# EAGLE design iv4_4lw_tubes_1.2.2 (EAGLE 5.07)
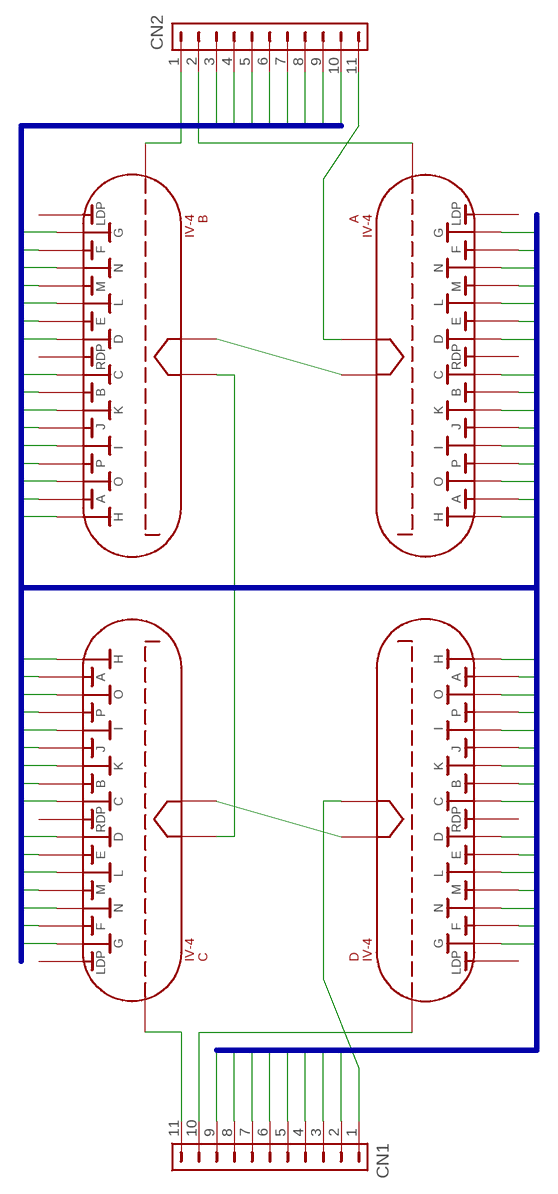
[diagram p0: schematic, sheet 1]

## Parts
A  IV-4  [IV-4]
B  IV-4  [IV-4]
C  IV-4  [IV-4]
CN1  HDR-1X11-SIP-100  [SIP-100-11V]
CN2  HDR-1X11-SIP-100  [SIP-100-11V]
D  IV-4  [IV-4]

## Nets
N$1: A.11 B.1
N$2: B.11 C.1
N$3: C.11 D.1
N$4: CN1.1 D.11
N$5: C.12 CN1.11
N$6: CN1.10 D.12
N$7: B.12 CN2.1
N$8: A.12 CN2.2
N$9: A.1 CN2.11
SEG1: A.3 B.3 C.3 CN2.7 D.3
SEG2: A.9 B.9 C.9 CN1.7 D.9
SEG4: A.14 B.14 C.14 CN1.5 D.14
SEG5: A.15 B.15 C.15 CN1.4 D.15
SEG6: A.19 B.19 C.19 CN2.4 D.19
SEG7: A.20 B.20 C.20 CN2.5 D.20
SEG9: A.6 B.6 C.6 CN2.10 D.6
SEG10: A.7 B.7 C.7 CN1.9 D.7
SEG11: A.8 B.8 C.8 CN1.8 D.8
SEG12: A.16 B.16 C.16 CN1.3 D.16
SEG13: A.17 B.17 C.17 CN1.2 D.17
SEG14: A.18 B.18 C.18 CN2.3 D.18
SEG15: A.4 B.4 C.4 CN2.8 D.4
SEG16: A.5 B.5 C.5 CN2.9 D.5
SEG17: A.21 B.21 C.21 CN2.6 D.21
SEG18: A.13 B.13 C.13 CN1.6 D.13
Unconnected: A.2 A.10 B.2 B.10 C.2 C.10 D.2 D.10

## Buses
SEG[1..18]

## Library data of the parts
A B C D = IV-4:IV-4
CN1 CN2 = con-hdrs40:HDR-1X11: HEADER CONNECTOR

## Board
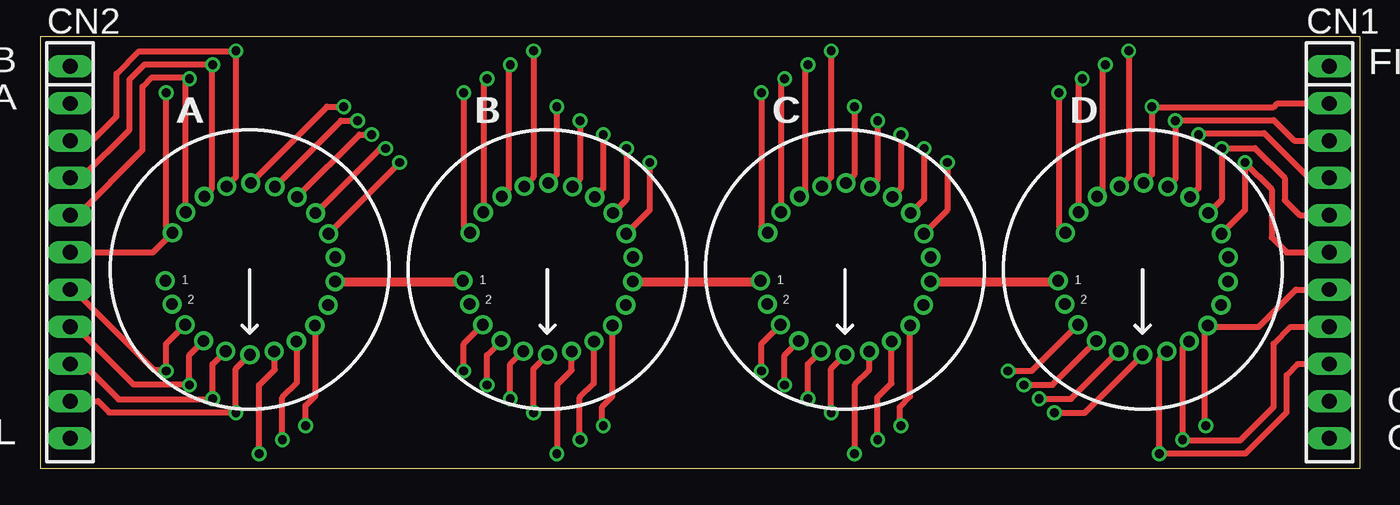
[diagram p1: board, top side]
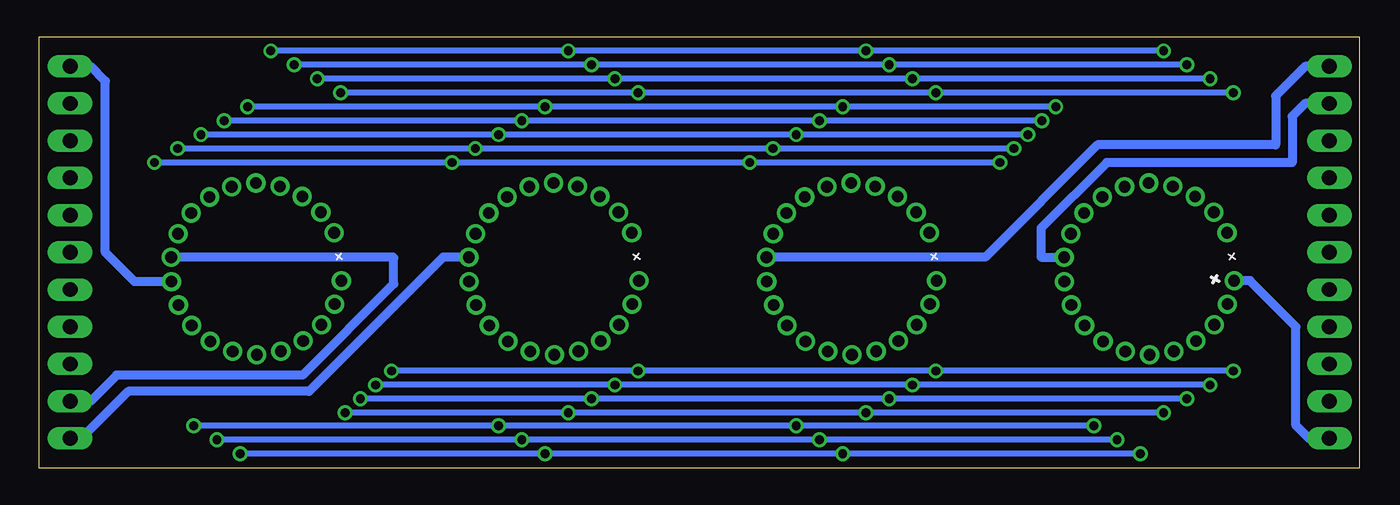
[diagram p2: board, bottom side, seen from below]

Size 90.13 x 29.46 mm. Coordinates in mm from the lower left corner, seen from the top.
Outline: 0,0 90.13,0 90.13,29.45 0,29.46 0,0
Copper layers (1*16): Top 0.035mm / dielectric 1.5mm / Bottom 0.035mm
Design rules "default *": minimum track width 8mil, minimum drill 5mil, track to track 5mil, track to pad 5mil, pad to pad 5mil, via to via 5mil, smd to smd 5mil, copper to edge 10mil, drill to drill 8mil, minimum pad ring 10mil, minimum via ring 8mil, stop-mask expansion 4mil, vias tented up to drill 0mil, thermal gap 10mil

### Footprints (pad centres in the part's own frame; a part is rotated, then mirrored left to right if it is on the bottom)
IV-4 = drill 0.8 round: 1 -5.769,-0.759; 2 -5.308,-2.362; 3 -4.414,-3.77; 4 -3.16,-4.869; 5 -1.647,-5.571; 6 0.003,-5.817; 7 1.655,-5.589; 8 3.176,-4.904; 9 4.442,-3.819; 10 5.352,-2.421; 11 5.831,-0.824; 12 5.84,0.844; 13 5.379,2.447; 14 4.485,3.855; 15 3.231,4.954; 16 1.717,5.655; 17 0.068,5.902; 18 -1.584,5.674; 19 -3.105,4.989; 20 -4.372,3.904; 21 -5.281,2.506
SIP-100-11V = drill 1.016 long: 1 -12.7,0; 2 -10.16,0; 3 -7.62,0; 4 -5.08,0; 5 -2.54,0; 6 0,0; 7 2.54,0; 8 5.08,0; 9 7.62,0; 10 10.16,0; 11 12.7,0

### Placement (x,y rotation side)
A  14.33,13.56 0 top
B  34.65,13.56 0 top
C  54.97,13.56 0 top
CN1  88.03,14.73 270 top
CN2  2.06,14.73 270 top
D  75.29,13.56 0 top

### Tracks (layer width: path | path; a pad name or v marks a point on that pad's centre or on a via)
N$1
  Top 0.61: B.1 28.81,12.74 A.11
N$2
  Top 0.61: C.1 49.13,12.74 B.11
N$3
  Top 0.61: D.1 69.45,12.74 C.11
N$4
  Bottom 0.61: D.11 83.62,12.74 85.62,14.73 85.62,26.42 86.64,27.43 CN1.1
N$5
  Bottom 0.61: C.12 62.56,14.4 71.72,5.24 84.07,5.24 87.27,2.03 CN1.11
N$6
  Bottom 0.61: D.12 65.99,14.4 65.94,14.35 65.94,12.57 72.16,6.35 84.86,6.35 86.64,4.57 CN1.10
N$7
  Bottom 0.61: B.12 25.55,14.4 17.88,22.07 5.73,22.07 5.73,25.41 3.71,27.43 CN2.1
N$8
  Bottom 0.61: A.12 21.74,14.4 21.74,16.38 17.26,20.86 4.6,20.86 4.6,24 3.71,24.89 CN2.2
N$9
  Bottom 0.61: A.1 7.49,12.8 4.34,9.65 4.34,2.92 3.45,2.03 CN2.11
SEG1  (via drill 0.6)
  Top 0.406: C.3 49.25,8.49 v49.25,6.64 | B.3 28.93,8.49 v28.93,6.64 | A.3 8.61,8.49 v8.61,6.64 8.52,6.73 7.77,6.73 2.31,12.19 CN2.7 | v66.09,6.64 67.72,6.64 D.3
  Bottom 0.406: v66.09,6.64 v49.25,6.64 v28.93,6.64 v8.61,6.64 8.61,6.61 8.62,6.6
SEG2  (via drill 0.6)
  Top 0.406: 79.63,2.91 v79.61,2.89 v79.6,2.89 | A.9 18.82,9.69 18.82,4.95 18.14,4.27 v18.14,2.89 | B.9 39.09,4.9 38.38,4.19 38.38,2.97 v38.46,2.89 | C.9 59.41,4.9 58.7,4.19 58.7,2.97 v58.78,2.89 | v79.6,2.89 79.53,2.89 79.53,9.54 D.9 79.82,9.65 83.21,9.65 85.75,12.19 CN1.7 | v79.6,2.89 79.63,2.92
  Bottom 0.406: v79.6,2.89 v58.78,2.89 v38.46,2.89 v18.14,2.89
SEG4  (via drill 0.6)
  Top 0.406: A.14 23.21,21.82 v23.6,21.82 | B.14 40.04,18.33 v40.04,21.82 | C.14 60.36,18.33 v60.36,21.82 | D.14 80.68,18.33 v80.68,21.82 80.71,21.85 82.95,21.85 84.99,19.81 84.99,18.29 86,17.27 CN1.5
  Bottom 0.406: v80.68,21.82 v60.36,21.82 39.98,21.82 | v23.6,21.82 39.98,21.82 | v40.04,21.82 40.04,21.86 40.03,21.87 39.98,21.82
SEG5  (via drill 0.6)
  Top 0.406: A.15 21.81,22.77 v22.64,22.77 | B.15 38.46,19.09 v38.46,22.77 | C.15 58.78,19.09 v58.78,22.77 | D.15 79.1,19.09 v79.1,22.77 79.19,22.86 83.59,22.86 86.64,19.81 CN1.4
  Bottom 0.406: v22.64,22.77 v38.46,22.77 v58.78,22.77 v79.1,22.77 79.1,22.81 79.12,22.78
SEG6  (via drill 0.6)
  Top 0.406: v11.79,27.53 | v11.79,27.53 v11.77,27.53 11.72,27.48 11.62,27.58 | B.19 31.98,18.99 31.98,27.4 v32.11,27.53 | v52.43,27.53 52.22,27.33 52.22,18.91 C.19 | v72.75,27.53 72.54,27.33 72.54,18.91 D.19 | A.19 11.71,19.04 11.71,27.45 v11.79,27.53 | CN2.4 2.82,19.81 6.12,23.12 6.12,26.54 7.14,27.56 11.76,27.56 v11.79,27.53
  Bottom 0.406: v72.75,27.53 v52.43,27.53 v32.11,27.53 v11.79,27.53
SEG7  (via drill 0.6)
  Top 0.406: v10.2,26.58 10.16,26.58 | 10.22,26.58 v10.2,26.58 | CN2.5 2.56,17.27 7.01,21.72 7.01,26.04 7.64,26.67 10.1,26.67 v10.2,26.58 | A.20 9.93,17.46 9.93,26.58 v10.2,26.58 | B.20 30.27,26.58 v30.52,26.58 | C.20 50.59,26.58 v50.84,26.58 | D.20 70.91,26.58 v71.16,26.58
  Bottom 0.406: v71.16,26.58 v50.84,26.58 v30.52,26.58 v10.2,26.58
SEG9  (via drill 0.6)
  Top 0.406: C.6 54.01,6.79 v54.01,3.78 | B.6 33.69,6.79 v33.69,3.78 | A.6 13.37,6.79 v13.37,3.78 13.34,3.81 4.72,3.81 3.96,4.57 CN2.10 | v69.25,3.78 71.33,3.78 D.6
  Bottom 0.406: v69.25,3.78 v54.01,3.78 v33.69,3.78 v13.37,3.78 13.37,3.75 13.32,3.7 13.22,3.8
SEG10  (via drill 0.6)
  Top 0.406: 76.41,0.99 76.33,0.91 | 76.41,0.99 v76.43,0.99 76.46,1.02 82.32,1.02 85.11,3.81 85.11,6.35 85.88,7.11 CN1.9 | 76.41,0.99 76.43,1.01 76.43,7.46 D.7 | A.7 16.03,7.93 16.03,6.73 14.96,5.67 v14.96,0.99 | B.7 36.3,6.69 35.33,5.72 35.33,1.04 v35.28,0.99 | C.7 56.62,6.69 55.65,5.72 55.65,1.04 v55.6,0.99
  Bottom 0.406: v76.43,0.99 v55.6,0.99 v35.28,0.99 v14.96,0.99
SEG11  (via drill 0.6)
  Top 0.406: 78.03,1.91 78.02,1.93 v78.02,1.94 | A.8 17.55,8.58 17.55,5.84 16.55,4.84 v16.55,1.94 | B.8 37.82,5.8 36.85,4.83 36.85,1.95 v36.87,1.94 | C.8 58.14,5.8 57.17,4.83 57.17,1.95 v57.19,1.94 | D.8 78.02,8.21 v78.02,1.94 | CN1.8 85.37,9.65 84.22,8.51 84.22,4.19 81.94,1.91 78.05,1.91 v78.02,1.94
  Bottom 0.406: v78.02,1.94 v57.19,1.94 v36.87,1.94 v16.55,1.94
SEG12  (via drill 0.6)
  Top 0.406: A.16 20.55,23.72 v21.69,23.72 | B.16 36.87,19.72 v36.87,23.72 | C.16 57.19,19.72 v57.19,23.72 | D.16 77.51,19.72 v77.51,23.72 77.54,23.75 84.22,23.75 85.62,22.35 CN1.3
  Bottom 0.406: v77.51,23.72 v57.19,23.72 v36.87,23.72 v21.69,23.72
SEG13  (via drill 0.6)
  Top 0.406: A.17 19.6,24.67 v20.74,24.67 | B.17 35.28,20.03 v35.28,24.67 | C.17 55.6,20.03 v55.6,24.67 | D.17 75.92,20.03 v75.92,24.67 75.95,24.64 84.22,24.64 84.48,24.89 CN1.2
  Bottom 0.406: 75.96,24.72 v75.92,24.67 v55.6,24.67 v35.28,24.67 v20.74,24.67
SEG14  (via drill 0.6)
  Top 0.406: v13.37,28.48 13.41,28.48 | 13.42,28.48 v13.37,28.48 | B.18 33.69,19.87 v33.69,28.48 | C.18 54.01,19.87 v54.01,28.48 | D.18 74.33,19.87 v74.33,28.48 | A.18 13.37,19.87 v13.37,28.48 | CN2.3 3.58,22.35 5.23,24 5.23,26.93 6.75,28.45 13.34,28.45 v13.37,28.48
  Bottom 0.406: v74.33,28.48 v54.01,28.48 v33.69,28.48 v13.37,28.48
SEG15  (via drill 0.6)
  Top 0.406: C.4 50.84,7.72 v50.84,5.69 | B.4 30.52,7.72 v30.52,5.69 | A.4 10.2,7.72 v10.2,5.69 10.17,5.72 6.37,5.72 2.44,9.65 CN2.8 | v67.17,5.69 69.12,5.69 D.4
  Bottom 0.406: v67.17,5.69 v50.84,5.69 v30.52,5.69 v10.2,5.69 10.21,5.69 10.22,5.7
SEG16  (via drill 0.6)
  Top 0.406: C.5 52.43,7.1 v52.43,4.73 | B.5 32.11,7.1 v32.11,4.73 | A.5 11.79,7.1 v11.79,4.73 11.75,4.7 5.36,4.7 2.94,7.11 CN2.9 | v68.21,4.73 70.38,4.73 D.5
  Bottom 0.406: v68.21,4.73 v52.43,4.73 v32.11,4.73 v11.79,4.73 11.82,4.7
SEG17  (via drill 0.6)
  Top 0.406: 8.53,25.73 8.61,25.66 v8.61,25.63 | 8.52,25.58 8.57,25.63 v8.61,25.63 | B.21 28.93,16.5 v28.93,25.63 | C.21 49.25,16.5 v49.25,25.63 | D.21 69.57,16.5 v69.57,25.63 | v8.61,25.63 8.61,16.5 A.21 7.71,14.73 CN2.6
  Bottom 0.406: v69.57,25.63 v49.25,25.63 v28.93,25.63 v8.61,25.63
SEG18  (via drill 0.6)
  Top 0.406: A.13 24.17,20.47 v24.55,20.86 | B.13 41.63,17.61 v41.63,20.86 | C.13 61.95,17.61 v61.95,20.86 | D.13 82.27,17.61 v82.27,20.86 84.1,19.04 84.1,15.75 85.11,14.73 CN1.6
  Bottom 0.406: v24.55,20.86 v41.63,20.86 v61.95,20.86 v82.27,20.86 82.24,20.86 82.22,20.88

### Text on the board
tPlace: GB | FIL | GA | I | P | J | O | K | A | B | H | C | G | D | F | E | N | L | M | GD | FIL | GC
_tplace: A | B | C | D